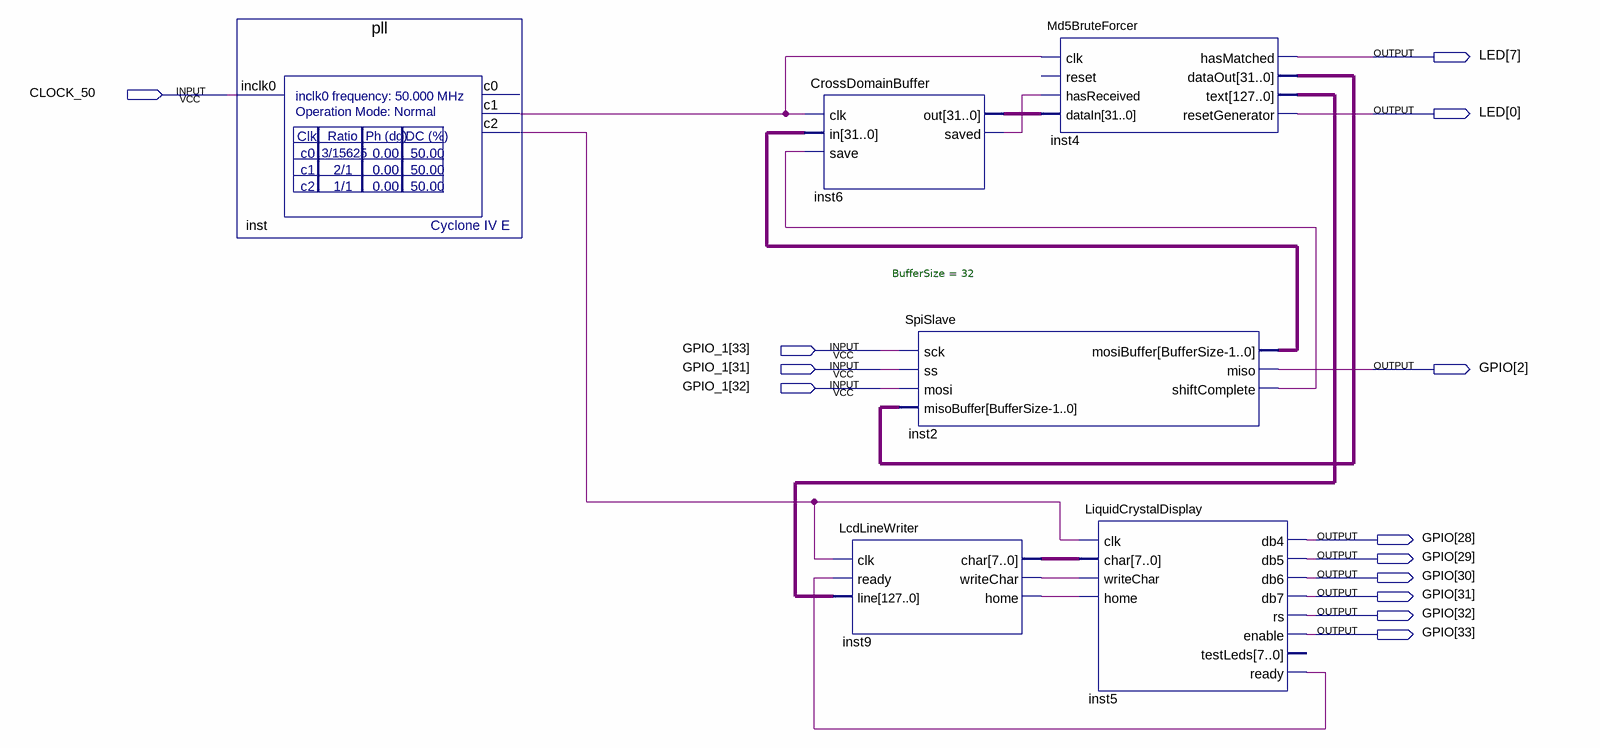
[diagram p0: schematic sheet]
// Quartus schematic Block3.bdf as structural Verilog: 6 symbols, 13 pins
module Block3 (
  input  CLOCK_50,
  input  [33:31] GPIO_1,
  output [7:0] LED,
  output [33:2] GPIO
);

  wire inst2_shiftcomplete, inst5_ready, inst6_saved, inst9_home, inst9_writechar, inst_c1, inst_c2;
  wire [7:0] inst9_char;
  wire [31:0] inst2_mosibuffer, inst4_dataout, inst6_out;
  wire [127:0] inst4_text;

  pll inst (.inclk0(CLOCK_50), .c1(inst_c1), .c2(inst_c2));  // open: c0
  CrossDomainBuffer inst6 (
    .clk(inst_c1), .in(inst2_mosibuffer), .save(inst2_shiftcomplete), .out(inst6_out), .saved(inst6_saved));
  LcdLineWriter inst9 (
    .clk(inst_c2), .ready(inst5_ready), .line(inst4_text), .char(inst9_char), .writeChar(inst9_writechar),
    .home(inst9_home));
  SpiSlave #(.BufferSize(32)) inst2 (
    .sck(GPIO_1[33]), .ss(GPIO_1[31]), .mosi(GPIO_1[32]), .misoBuffer(inst4_dataout),
    .mosiBuffer(inst2_mosibuffer), .miso(GPIO[2]), .shiftComplete(inst2_shiftcomplete));
  Md5BruteForcer inst4 (
    .clk(inst_c1), .hasReceived(inst6_saved), .dataIn(inst6_out), .hasMatched(LED[7]),
    .dataOut(inst4_dataout), .text(inst4_text), .resetGenerator(LED[0]));  // open: reset
  LiquidCrystalDisplay inst5 (
    .clk(inst_c2), .char(inst9_char), .writeChar(inst9_writechar), .home(inst9_home), .db4(GPIO[28]),
    .db5(GPIO[29]), .db6(GPIO[30]), .db7(GPIO[31]), .rs(GPIO[32]), .enable(GPIO[33]), .ready(inst5_ready));  // open: testLeds
endmodule
